# EAGLE schematic OpenPad (EAGLE 6.4)
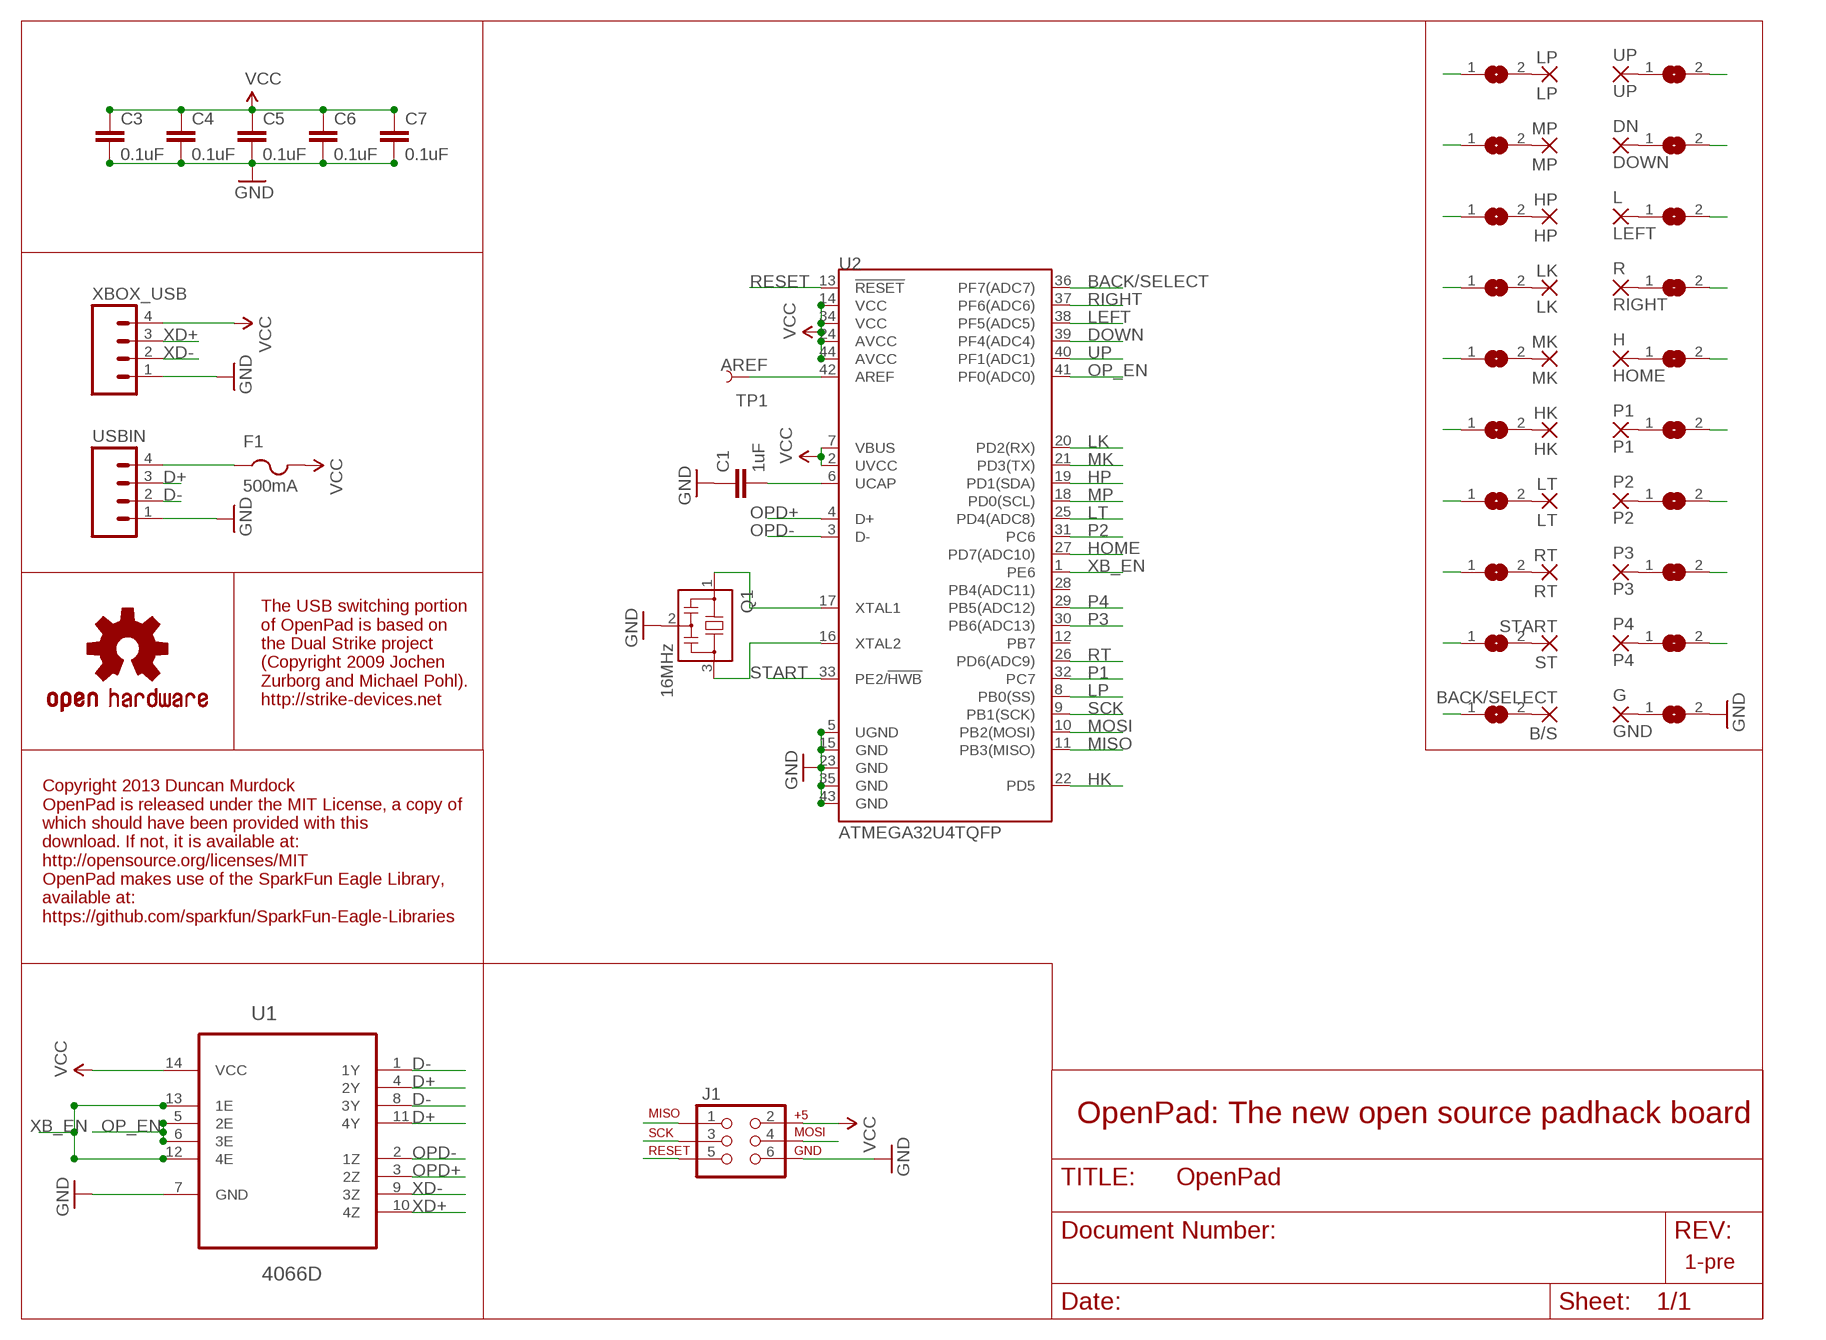
[diagram p0: schematic, sheet 1]

## Parts
B/S  BACK/SELECT  WIREPADSMD5-2,5  [5-2,5]
C1  1uF  0.1UF-25V(+80/-20%)(0603)  [0402-CAP]
C3  0.1uF  0.1UF-25V(+80/-20%)(0603)  [0402-CAP]
C4  0.1uF  0.1UF-25V(+80/-20%)(0603)  [0402-CAP]
C5  0.1uF  0.1UF-25V(+80/-20%)(0603)  [0402-CAP]
C6  0.1uF  0.1UF-25V(+80/-20%)(0603)  [0402-CAP]
C7  0.1uF  0.1UF-25V(+80/-20%)(0603)  [0402-CAP]
DN  DOWN  WIREPADSMD5-2,5  [5-2,5]
F1  500mA  PTCFUSE-1812  [1812]
G  GND  WIREPADSMD5-2,5  [5-2,5]
H  HOME  WIREPADSMD5-2,5  [5-2,5]
HK  HK  WIREPADSMD5-2,5  [5-2,5]
HP  HP  WIREPADSMD5-2,5  [5-2,5]
J1  AVR_SPI_PRG_62X3_LOCK  [2X3_LOCK]
L  LEFT  WIREPADSMD5-2,5  [5-2,5]
LK  LK  WIREPADSMD5-2,5  [5-2,5]
LOGO2  OSHW-LOGOM  [OSHW-LOGO-M]
LP  LP  WIREPADSMD5-2,5  [5-2,5]
LT  LT  WIREPADSMD5-2,5  [5-2,5]
MK  MK  WIREPADSMD5-2,5  [5-2,5]
MP  MP  WIREPADSMD5-2,5  [5-2,5]
P1  P1  WIREPADSMD5-2,5  [5-2,5]
P2  P2  WIREPADSMD5-2,5  [5-2,5]
P3  P3  WIREPADSMD5-2,5  [5-2,5]
P4  P4  WIREPADSMD5-2,5  [5-2,5]
Q1  16MHz  CSTCR6M00G53Z  [CSTCR6M]
R  RIGHT  WIREPADSMD5-2,5  [5-2,5]
RT  RT  WIREPADSMD5-2,5  [5-2,5]
SJ1  SJW  [SJW]
SJ2  SJW  [SJW]
SJ3  SJW  [SJW]
SJ4  SJW  [SJW]
SJ5  SJW  [SJW]
SJ6  SJW  [SJW]
SJ7  SJW  [SJW]
SJ8  SJW  [SJW]
SJ9  SJW  [SJW]
SJ10  SJW  [SJW]
SJ11  SJW  [SJW]
SJ12  SJW  [SJW]
SJ13  SJW  [SJW]
SJ14  SJW  [SJW]
SJ15  SJW  [SJW]
SJ16  SJW  [SJW]
SJ17  SJW  [SJW]
SJ18  SJW  [SJW]
SJ19  SJW  [SJW]
SJ20  SJW  [SJW]
ST  START  WIREPADSMD5-2,5  [5-2,5]
TP1  AREF  TEST-POINT2  [PAD.02X.02]
U1  4066D  74HC4066D  [SOIC127P600X175-14N]
U2  ATMEGA32U4TQFP  [SPARKFUN-DIGITALIC_TQFP44]
UP  UP  WIREPADSMD5-2,5  [5-2,5]
USBIN  M04LOCK_LONGPADS  [1X04_LOCK_LONGPADS]
XBOX_USB  M04LOCK_LONGPADS  [1X04_LOCK_LONGPADS]

## Nets
BACK/SELECT: SJ10.1 U2.36(PF7(ADC7))
D+: U1.4(2Y) U1.11(4Y) USBIN.3
D-: U1.1(1Y) U1.8(3Y) USBIN.2
DOWN: SJ12.2 U2.39(PF4(ADC4))
GND: C1.1 C3.2 C4.2 C5.2 C6.2 C7.2 J1.6 Q1.2 SJ20.2 U1.7(GND) U2.5(UGND) U2.15(GND) U2.23(GND) U2.35(GND) U2.43(GND) USBIN.1 XBOX_USB.1
HK: SJ6.1 U2.22(PD5)
HOME: SJ15.2 U2.27(PD7(ADC10))
HP: SJ3.1 U2.19(PD1(SDA))
LEFT: SJ13.2 U2.38(PF5(ADC5))
LK: SJ4.1 U2.20(PD2(RX))
LP: SJ1.1 U2.8(PB0(SS))
LT: SJ7.1 U2.25(PD4(ADC8))
MISO: J1.1 U2.11(PB3(MISO))
MK: SJ5.1 U2.21(PD3(TX))
MOSI: J1.4 U2.10(PB2(MOSI))
MP: SJ2.1 U2.18(PD0(SCL))
N$1: Q1.3 U2.16(XTAL2)
N$2: Q1.1 U2.17(XTAL1)
N$3: LP.1(P) SJ1.2
N$4: F1.1 USBIN.4
N$5: MP.1(P) SJ2.2
N$6: HP.1(P) SJ3.2
N$7: LK.1(P) SJ4.2
N$8: MK.1(P) SJ5.2
N$9: HK.1(P) SJ6.2
N$10: LT.1(P) SJ7.2
N$11: RT.1(P) SJ8.2
N$12: SJ9.2 ST.1(P)
N$13: B/S.1(P) SJ10.2
N$14: SJ11.1 UP.1(P)
N$15: DN.1(P) SJ12.1
N$16: L.1(P) SJ13.1
N$17: R.1(P) SJ14.1
N$18: H.1(P) SJ15.1
N$19: P2.1(P) SJ17.1
N$20: P3.1(P) SJ18.1
N$21: P4.1(P) SJ19.1
N$22: G.1(P) SJ20.1
N$23: P1.1(P) SJ16.1
N$24: TP1.P$1 U2.42(AREF)
N$25: C1.2 U2.6(UCAP)
OP_EN: U1.5(2E) U1.6(3E) U2.41(PF0(ADC0))
OPD+: U1.3(2Z) U2.4(D+)
OPD-: U1.2(1Z) U2.3(D-)
P1: SJ16.2 U2.32(PC7)
P2: SJ17.2 U2.31(PC6)
P3: SJ18.2 U2.30(PB6(ADC13))
P4: SJ19.2 U2.29(PB5(ADC12))
RESET: J1.5 U2.13(!RESET)
RIGHT: SJ14.2 U2.37(PF6(ADC6))
RT: SJ8.1 U2.26(PD6(ADC9))
SCK: J1.3 U2.9(PB1(SCK))
START: SJ9.1 U2.33(PE2/!HWB)
UP: SJ11.2 U2.40(PF1(ADC1))
VCC: C3.1 C4.1 C5.1 C6.1 C7.1 F1.2 J1.2 U1.14(VCC) U2.2(UVCC) U2.7(VBUS) U2.14(VCC) U2.24(AVCC) U2.34(VCC) U2.44(AVCC) XBOX_USB.4
XB_EN: U1.12(4E) U1.13(1E) U2.1(PE6)
XD+: U1.10(4Z) XBOX_USB.3
XD-: U1.9(3Z) XBOX_USB.2
Unconnected: U2.12(PB7) U2.28(PB4(ADC11))

## Notes on the sheet
- The USB switching portion
  of OpenPad is based on
  the Dual Strike project
  (Copyright 2009 Jochen
  Zurborg and Michael Pohl).
  http://strike-devices.net
- Copyright 2013 Duncan Murdock
  OpenPad is released under the MIT License, a copy of
  which should have been provided with this 
  download. If not, it is available at:
  http://opensource.org/licenses/MIT
  OpenPad makes use of the SparkFun Eagle Library, 
  available at:
  https://github.com/sparkfun/SparkFun-Eagle-Libraries
- OpenPad: The new open source padhack board
- 1-pre

## Library data of the parts
B/S DN G H HK HP L LK LP LT MK MP P1-P4 R RT ST UP = wirepad:WIREPAD: Wire PAD connect wire on PCB
C1 = SparkFun-Capacitors:0.1UF-25V(+80/-20%)(0603): Ceramic Standard decoupling cap CAP-00810; PROD_ID: CAP-00810; VALUE: 0.1uF
C3-C7 = SparkFun-Capacitors:0.1UF-25V(+80/-20%)(0603): Ceramic Standard decoupling cap CAP-00810; PROD_ID: CAP-00810
F1 = adafruit:PTCFUSE: PTC fuses, resettable thermistors
J1 = SparkFun-Connectors:AVR_SPI_PRG_6: AVR ISP 6 Pin This is the reduced ISP connector for AVR programming. Common on Arduino. This footprint will take up less PCB space and can be used with a 10-pin to 6-pin adapter such as SKU: BOB-08508
LOGO2 = SparkFun-Aesthetics:OSHW-LOGO: Open Source Hardware Logo This logo indicates the piece of hardware it is found on incorporates a OSHW license and/or adheres to the definition of open source hardware found here: http://freedomdefined.org/OSHW
Q1 = murata-filter:CSTCR: Resonator Source: murata.co.jp; MPN: CSTCR6M00G53-R0; OC_FARNELL: 1170434; OC_NEWARK: 25M8759
SJ1-SJ20 = jumper:SJ: SMD solder JUMPER
TP1 = SparkFun-Passives:TEST-POINT: Bare copper test points for troubleshooting or ICT
U1 = NXP_By_element14_Batch_1:74HC4066D: Quad bilateral switches; MPN: 74HC4066D; OC_FARNELL: 1201330; OC_NEWARK: 26M7766; PACKAGE: SOIC-14; SUPPLIER: NXP
U2 = SparkFun-DigitalIC:ATMEGA32U4: Atmel 44-pin 8-bit Microcontroller with 32KBytes of ISP Flash and USB Controller
USBIN XBOX_USB = SparkFun-Connectors:M04: Header 4 Standard 4-pin 0.1" header. Use with straight break away headers (SKU : PRT-00116), right angle break away headers (PRT-00553), swiss pins (PRT-00743), machine pins (PRT-00117), and female headers (PRT-00115). Molex polarized connector foot print use with SKU : PRT-08231 with associated crimp pins and housings. 1MM SMD Version SKU: PRT-10208